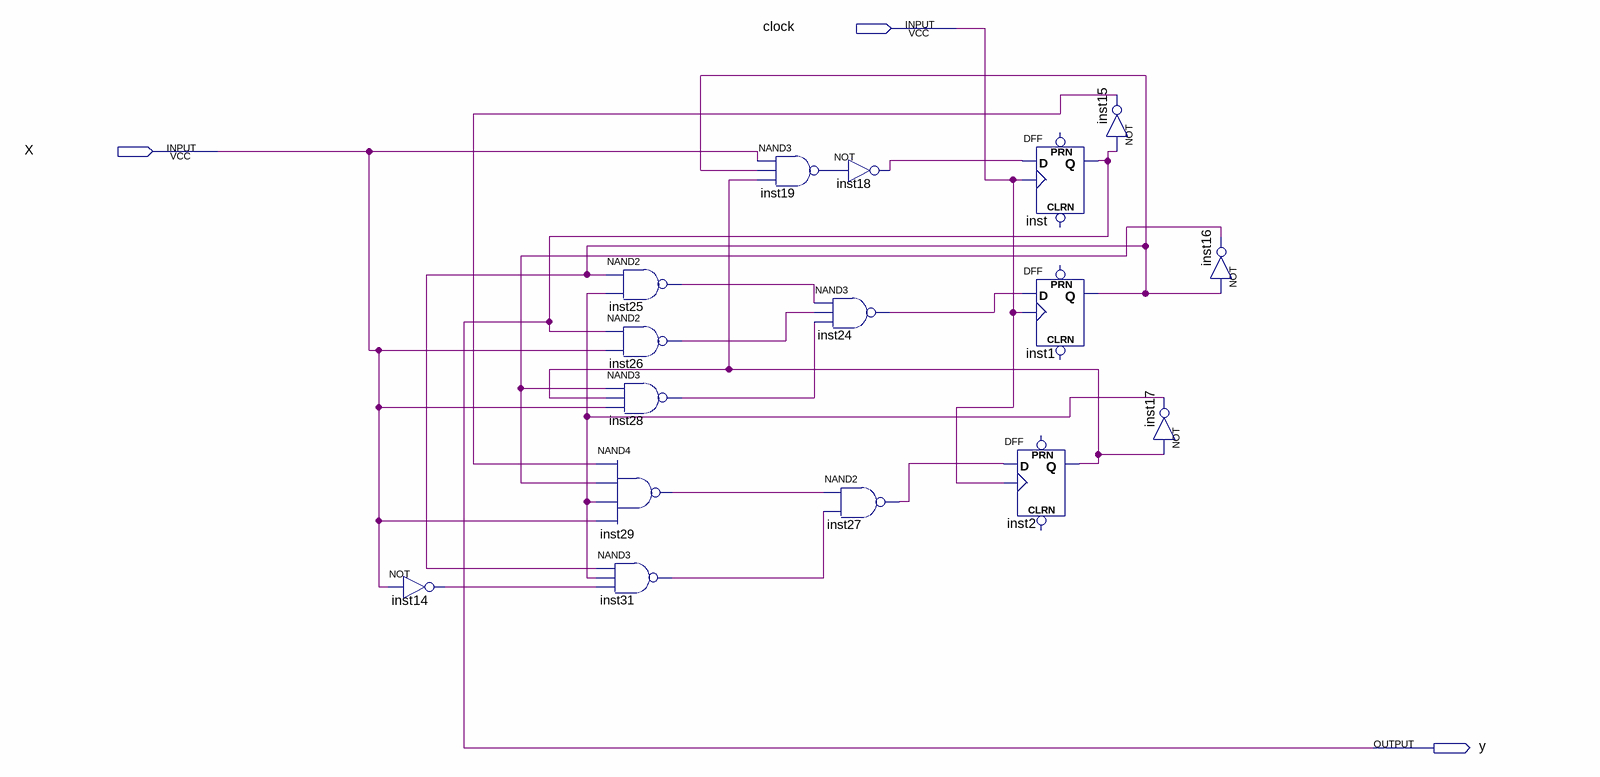
[diagram p0: schematic sheet]
// Quartus schematic sequence_recognizer.bdf as structural Verilog: 16 symbols, 3 pins
module sequence_recognizer (
  input  clock,
  input  X,
  output y
);

  wire inst1_q, inst2_q, inst14_out, inst15_out, inst16_out, inst17_out, inst18_out, inst19_out, inst24_out,
       inst25_out, inst26_out, inst27_out, inst28_out, inst29_out, inst31_out;

  not inst14 (inst14_out, X);
  nand inst29 (inst29_out, inst15_out, inst16_out, inst17_out, X);
  nand inst31 (inst31_out, inst1_q, inst17_out, inst14_out);
  nand inst25 (inst25_out, inst1_q, inst17_out);
  nand inst26 (inst26_out, y, X);
  nand inst28 (inst28_out, inst16_out, inst2_q, X);
  nand inst19 (inst19_out, X, inst1_q, inst2_q);
  nand inst24 (inst24_out, inst25_out, inst26_out, inst28_out);
  nand inst27 (inst27_out, inst29_out, inst31_out);
  not inst18 (inst18_out, inst19_out);
  DFF inst (.CLK(clock), .D(inst18_out), .Q(y));  // open: CLRN, PRN
  DFF inst1 (.CLK(clock), .D(inst24_out), .Q(inst1_q));  // open: CLRN, PRN
  DFF inst2 (.CLK(clock), .D(inst27_out), .Q(inst2_q));  // open: CLRN, PRN
  not inst15 (inst15_out, y);
  not inst16 (inst16_out, inst1_q);
  not inst17 (inst17_out, inst2_q);
endmodule
